# EAGLE design thermoc (EAGLE 5.11)
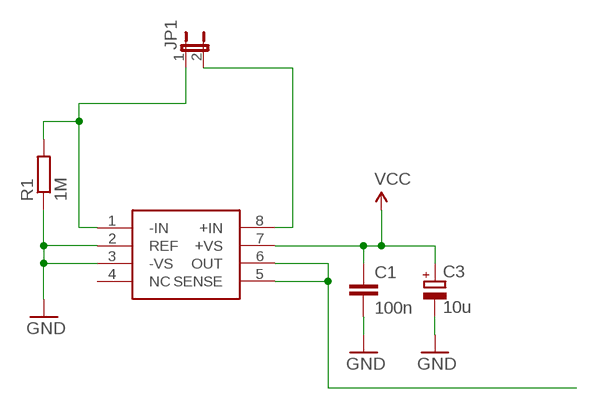
[diagram p0: schematic, sheet 1]

## Parts
C1  100n  C-EUC0805  [C0805]
C3  10u  CPOL-EU153CLV-0405  [153CLV-0405]
JP1  JP1E  [JP1]
R1  1M  R-EU_M0805  [M0805]
U$1  AD8495  [MSOP08]

## Nets
GND: C1.2 C3.- R1.1 U$1.2(REF) U$1.3(-VS)
N$1: JP1.2 U$1.8(+IN)
N$2: U$1.5(SENSE) U$1.6(OUT)
N$3: JP1.1 R1.2 U$1.1(-IN)
VCC: C1.1 C3.+ U$1.7(+VS)
Unconnected: U$1.4(NC)

## Library data of the parts
C1 = rcl:C-EU: CAPACITOR, European symbol
C3 = rcl:CPOL-EU: POLARIZED CAPACITOR, European symbol
JP1 = jumper:JP1E: JUMPER
R1 = rcl:R-EU_: RESISTOR, European symbol
U$1 = SparkFun:AD8495: AD8495 Precision Thermocouple Amplifier with Cold Junction Compensation http://www.analog.com/static/imported-files/data_sheets/AD8494_8495_8496_8497.pdf

## Board
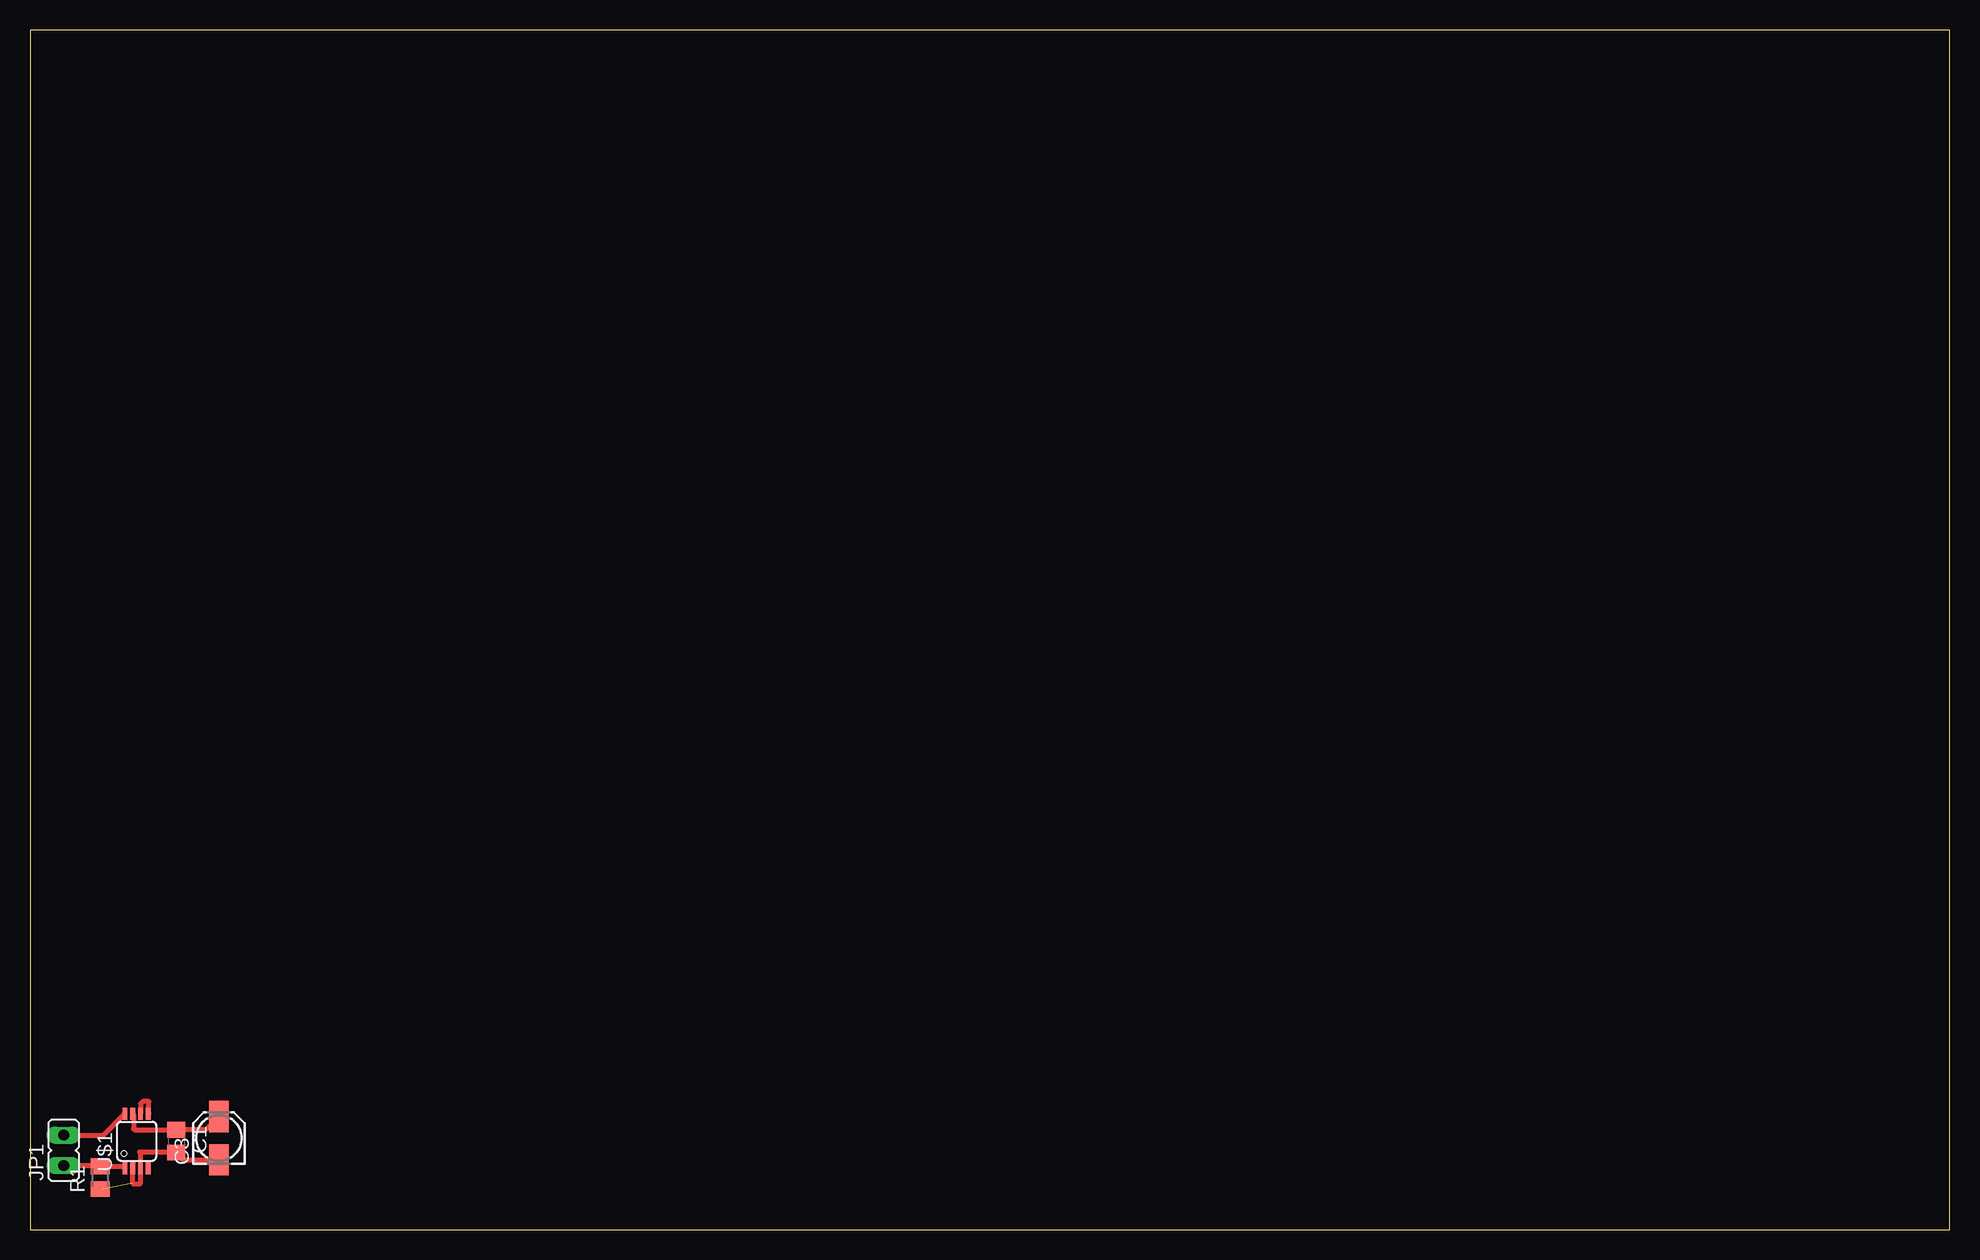
[diagram p1: board, top side]

Size 160 x 100 mm. Coordinates in mm from the lower left corner, seen from the top.
Outline: 0,0 160,0 160,100 0,100 0,0
Copper layers (1*16): Top 0.035mm / dielectric 1.5mm / Bottom 0.035mm
Design rules "default": minimum track width 10mil, minimum drill 24mil, track to track 8mil, track to pad 8mil, pad to pad 8mil, via to via 8mil, smd to smd 8mil, copper to edge 40mil, drill to drill 8mil, minimum pad ring 10mil, minimum via ring 8mil, stop-mask expansion 4mil, vias tented up to drill 0mil, thermal gap 10mil

### Footprints (pad centres in the part's own frame; a part is rotated, then mirrored left to right if it is on the bottom)
C0805 = smd 1.3 x 1.5: 1 -0.95,0; 2 0.95,0
153CLV-0405 = smd 2.6 x 1.6: + 1.8,0; - -1.8,0
JP1 = drill 0.914 long: 1 0,-1.27; 2 0,1.27
M0805 = smd 1.3 x 1.6: 1 -0.95,0; 2 0.95,0
MSOP08 = smd 0.4 x 1: 1 -0.976,-2.263; 2 -0.326,-2.263; 3 0.324,-2.263; 4 0.974,-2.263; 5 0.974,2.262; 6 0.324,2.262; 7 -0.326,2.262; 8 -0.976,2.262

### Placement (x,y rotation side)
C1  12.19,7.37 270 top
C3  15.75,7.62 90 top
JP1  2.79,6.6 0 top
R1  5.84,4.32 90 top
U$1  8.89,7.37 0 top

### Tracks (layer width: path | path; a pad name or v marks a point on that pad's centre or on a via)
GND  (1 unrouted)
  Top 0.406: U$1.2 8.56,3.88 8.64,3.81 9.14,3.81 9.21,3.88 U$1.3 9.21,6.41 9.14,6.48 12.13,6.48 C1.2 12.79,5.82 C3.-
N$1
  Top 0.406: JP1.2 6.16,7.87 U$1.8
N$2
  Top 0.406: U$1.5 9.91,9.67 9.91,10.67 9.4,10.67 9.21,10.48 U$1.6
N$3
  Top 0.406: JP1.1 5.78,5.33 R1.2 7.75,5.27 U$1.1
VCC
  Top 0.406: U$1.7 8.64,9.56 8.64,8.38 8.7,8.32 C1.1 14.64,8.32 C3.+